# Altium project 105358-3BA002-01_EFM1-hybrid.PrjPCB (part 2 of 2)

## Sheet 105358-3SC002-01-A_IR.SchDoc: I/O Board
size 420 x 297 mm; DrawnBy: JeSa , KaKa; Organization: Hotswap Norden AB; Address1: Knarrarnäsgatan 7; Address2: SE-164 40 Kista; Address3: Sweden; DocumentNumber: 105358-3SC001-01; SheetNumber: 5; SheetTotal: 5; PageSetup: Record=PageOptions|CenterHorizontal=True|CenterVertical=True|PrintScale=0.96|XCorrection=1.00|YCorrection=1.00|PrintKind=0|BorderSize=5000000|LeftOffset=0|BottomOffset=0|Orientation=2|PaperLength=1000|PaperWidth=1000|Scale=100|PaperSource=7|PrintQuality=-4|MediaType=1|DitherType=10|PaperKind=A3|PrintScaleMode=1
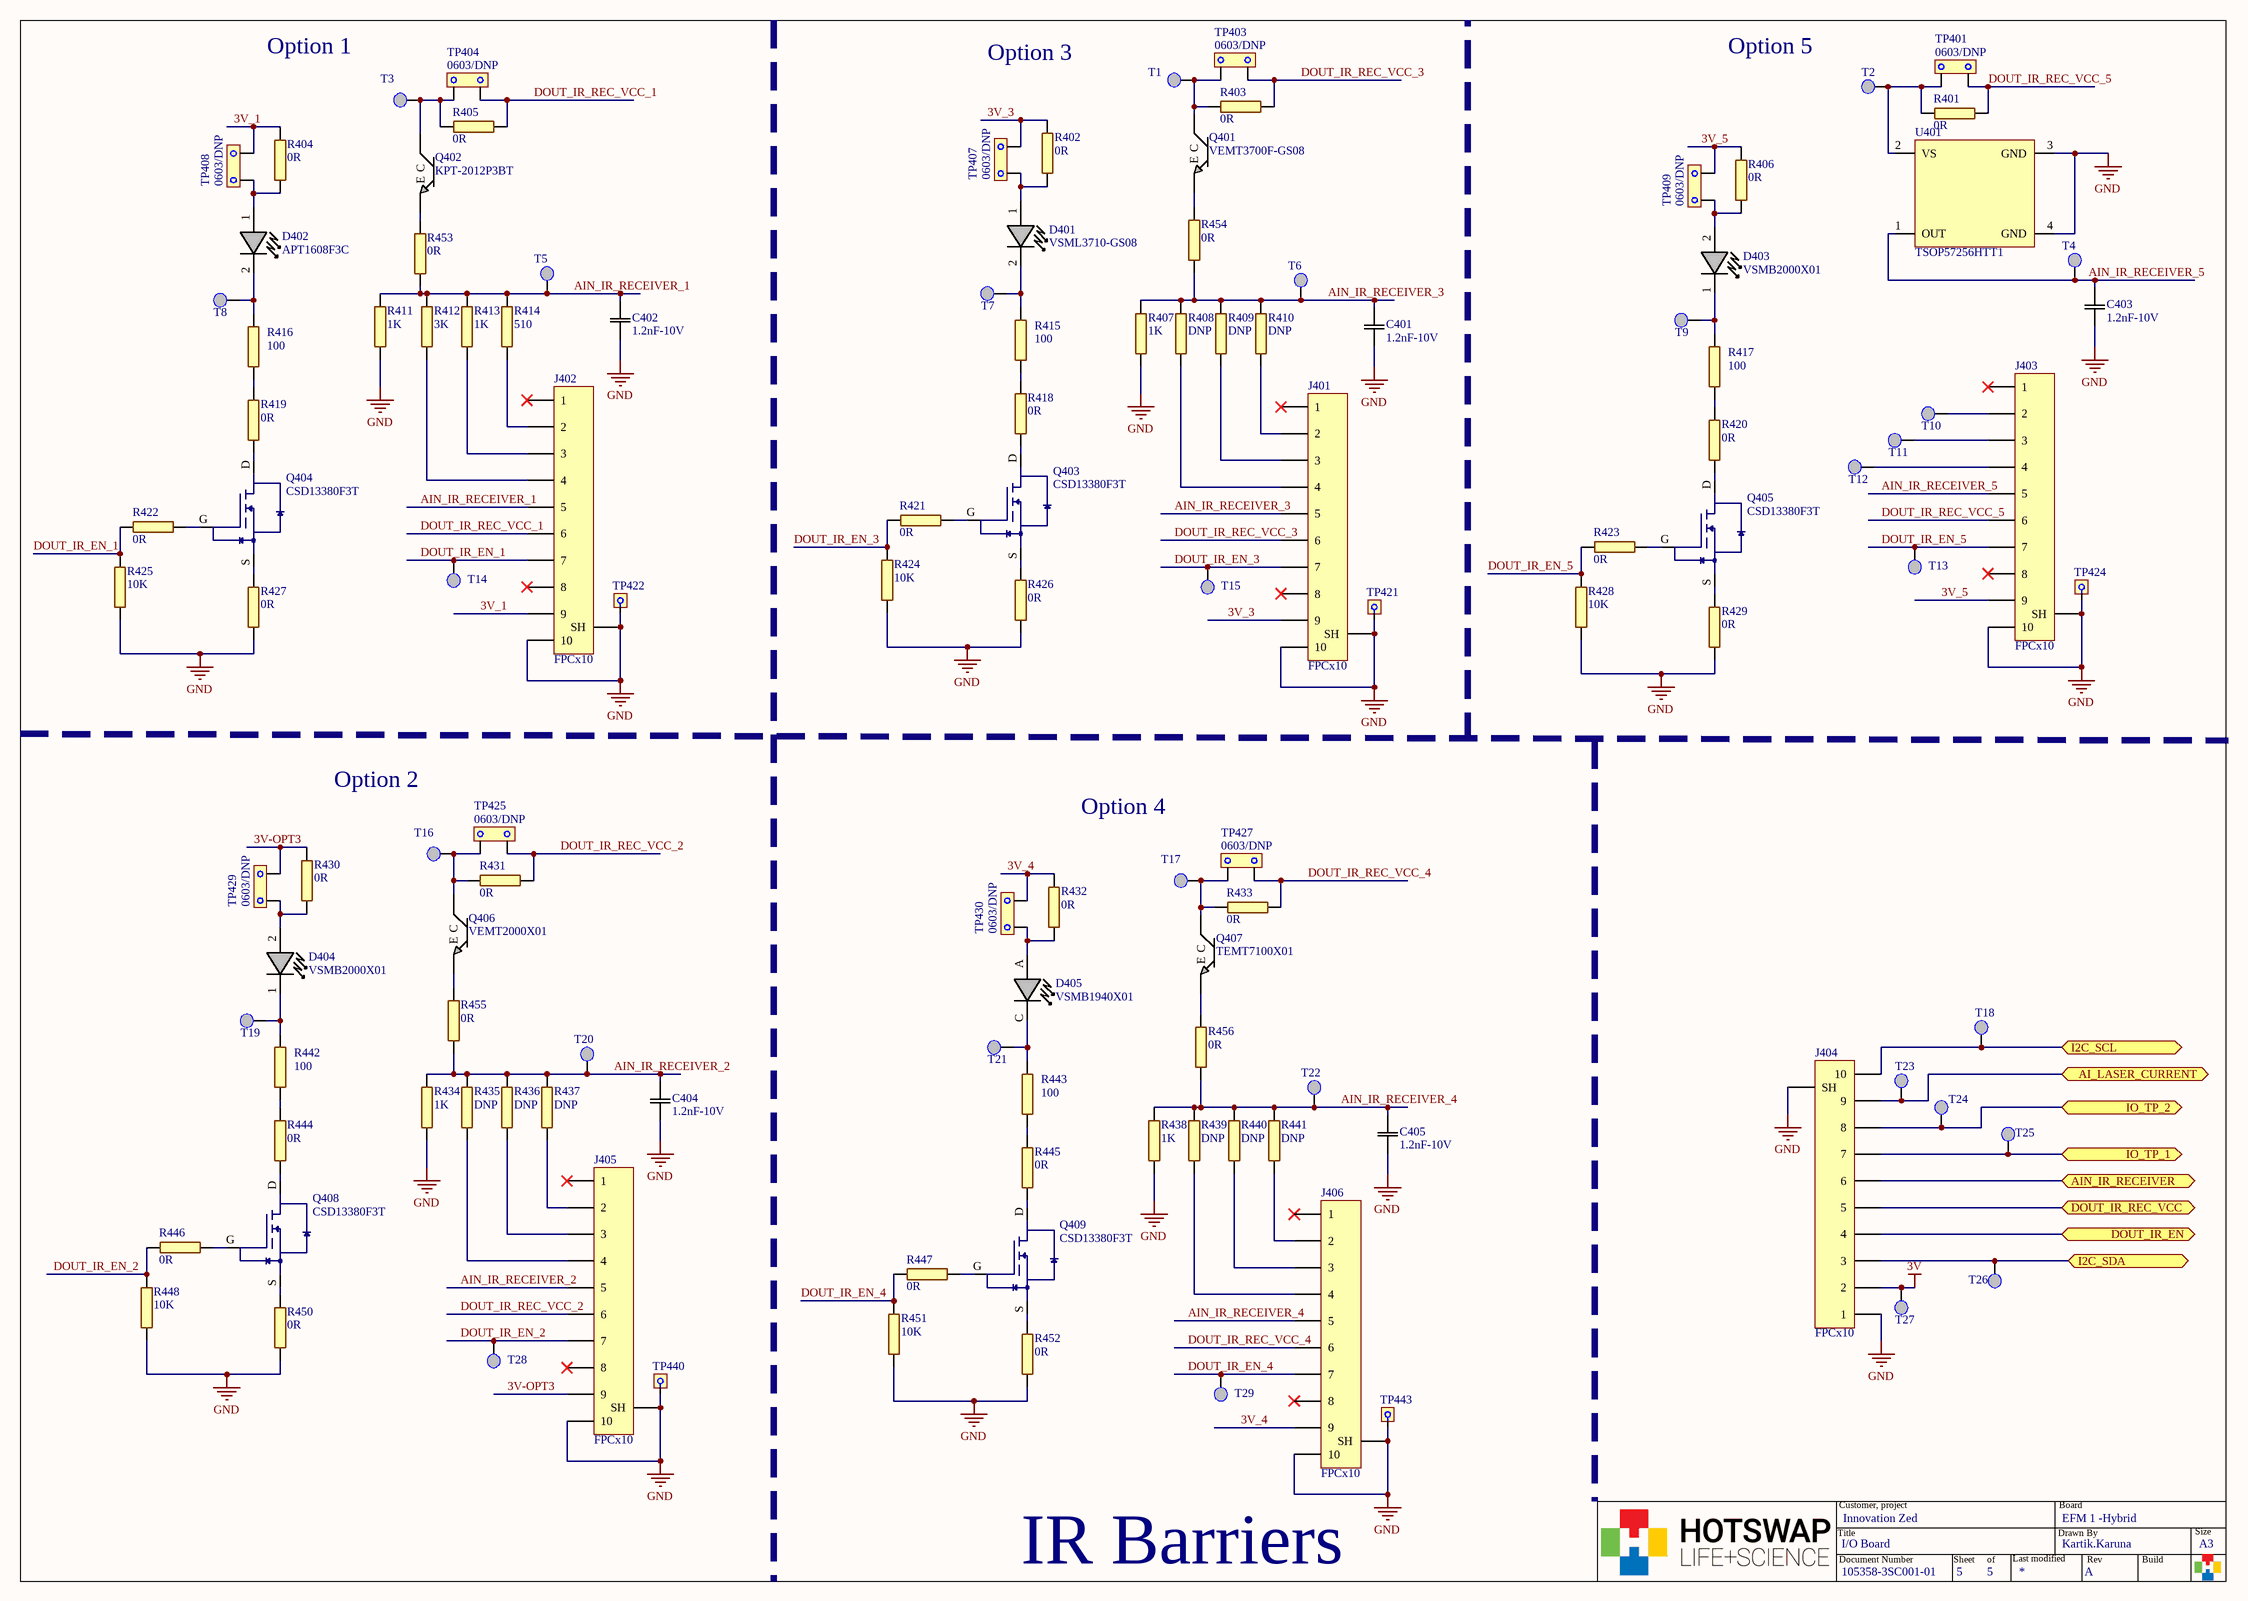
[diagram p4: 105358-3SC002-01-A_IR.SchDoc]

### Parts
C401  1.2nF-10V  [0402C_HIGH_DENSITY]
C402  1.2nF-10V  [0402C_HIGH_DENSITY]
C403  1.2nF-10V  [0402C_HIGH_DENSITY]
C404  1.2nF-10V  [0402C_HIGH_DENSITY]
C405  1.2nF-10V  [0402C_HIGH_DENSITY]
D401  VSML3710-GS08  [VSML3710-GS08]
D402  APT1608F3C  [APT1608F3C]
D403  VSMB2000X01  [SODFL580X160]
D404  VSMB2000X01  [SODFL580X160]
D405  VSMB1940X01  [VSMB1940X01]
J401  FPCx10  [FPCx10-5034801000]
J402  FPCx10  [FPCx10-5034801000]
J403  FPCx10  [FPCx10-5034801000]
J404  FPCx10  [FPCx10-5034801000]
J405  FPCx10  [FPCx10-5034801000]
J406  FPCx10  [FPCx10-5034801000]
Q401  VEMT3700F-GS08  [VEMT3700F-GS08]
Q402  KPT-2012P3BT  [APT2012P3BT]
Q403  CSD13380F3T  [CSD13380F3-DFN40P69X35-3L]
Q404  CSD13380F3T  [CSD13380F3-DFN40P69X35-3L]
Q405  CSD13380F3T  [CSD13380F3-DFN40P69X35-3L]
Q406  VEMT2000X01  [SODFL580X160]
Q407  TEMT7100X01  [TEMT7100X01]
Q408  CSD13380F3T  [CSD13380F3-DFN40P69X35-3L]
Q409  CSD13380F3T  [CSD13380F3-DFN40P69X35-3L]
R401  0R  [0603R-GENRIC]
R402  0R  [0603R-GENRIC]
R403  0R  [0603R-GENRIC]
R404  0R  [0603R-GENRIC]
R405  0R  [0603R-GENRIC]
R406  0R  [0603R-GENRIC]
R407  1K  [0402R-GENERIC]
R408  DNP  [0603R-GENRIC]
R409  DNP  [0603R-GENRIC]
R410  DNP  [0603R-GENRIC]
R411  1K  [0402R-GENERIC]
R412  3K  [0402R-GENERIC]
R413  1K  [0402R-GENERIC]
R414  510  [0402R-GENERIC]
R415  100  [0402R-GENERIC]
R416  100  [0402R-GENERIC]
R417  100  [0402R-GENERIC]
R418  0R  [0603R-GENRIC]
R419  0R  [0603R-GENRIC]
R420  0R  [0603R-GENRIC]
R421  0R  [0603R-GENRIC]
R422  0R  [0603R-GENRIC]
R423  0R  [0603R-GENRIC]
R424  10K  [0402R-GENERIC]
R425  10K  [0402R-GENERIC]
R426  0R  [0603R-GENRIC]
R427  0R  [0603R-GENRIC]
R428  10K  [0402R-GENERIC]
R429  0R  [0603R-GENRIC]
R430  0R  [0603R-GENRIC]
R431  0R  [0603R-GENRIC]
R432  0R  [0603R-GENRIC]
R433  0R  [0603R-GENRIC]
R434  1K  [0402R-GENERIC]
R435  DNP  [0603R-GENRIC]
R436  DNP  [0603R-GENRIC]
R437  DNP  [0603R-GENRIC]
R438  1K  [0402R-GENERIC]
R439  DNP  [0603R-GENRIC]
R440  DNP  [0603R-GENRIC]
R441  DNP  [0603R-GENRIC]
R442  100  [0402R-GENERIC]
R443  100  [0402R-GENERIC]
R444  0R  [0603R-GENRIC]
R445  0R  [0603R-GENRIC]
R446  0R  [0603R-GENRIC]
R447  0R  [0603R-GENRIC]
R448  10K  [0402R-GENERIC]
R450  0R  [0603R-GENRIC]
R451  10K  [0402R-GENERIC]
R452  0R  [0603R-GENRIC]
R453  0R  [0603R-GENRIC]
R454  0R  [0603R-GENRIC]
R455  0R  [0603R-GENRIC]
R456  0R  [0603R-GENRIC]
T1  TEST POINT  [PAD TEST POINT]  (value not drawn)  (no BOM)
T2  TEST POINT  [PAD TEST POINT]  (value not drawn)  (no BOM)
T3  TEST POINT  [PAD TEST POINT]  (value not drawn)  (no BOM)
T4  TEST POINT  [PAD TEST POINT]  (value not drawn)  (no BOM)
T5  TEST POINT  [PAD TEST POINT]  (value not drawn)  (no BOM)
T6  TEST POINT  [PAD TEST POINT]  (value not drawn)  (no BOM)
T7  TEST POINT  [PAD TEST POINT]  (value not drawn)  (no BOM)
T8  TEST POINT  [PAD TEST POINT]  (value not drawn)  (no BOM)
T9  TEST POINT  [PAD TEST POINT]  (value not drawn)  (no BOM)
T10  TEST POINT  [PAD TEST POINT]  (value not drawn)  (no BOM)
T11  TEST POINT  [PAD TEST POINT]  (value not drawn)  (no BOM)
T12  TEST POINT  [PAD TEST POINT]  (value not drawn)  (no BOM)
T13  TEST POINT  [PAD TEST POINT]  (value not drawn)  (no BOM)
T14  TEST POINT  [PAD TEST POINT]  (value not drawn)  (no BOM)
T15  TEST POINT  [PAD TEST POINT]  (value not drawn)  (no BOM)
T16  TEST POINT  [PAD TEST POINT]  (value not drawn)  (no BOM)
T17  TEST POINT  [PAD TEST POINT]  (value not drawn)  (no BOM)
T18  TEST POINT  [PAD TEST POINT]  (value not drawn)  (no BOM)
T19  TEST POINT  [PAD TEST POINT]  (value not drawn)  (no BOM)
T20  TEST POINT  [PAD TEST POINT]  (value not drawn)  (no BOM)
T21  TEST POINT  [PAD TEST POINT]  (value not drawn)  (no BOM)
T22  TEST POINT  [PAD TEST POINT]  (value not drawn)  (no BOM)
T23  TEST POINT  [PAD TEST POINT]  (value not drawn)  (no BOM)
T24  TEST POINT  [PAD TEST POINT]  (value not drawn)  (no BOM)
T25  TEST POINT  [PAD TEST POINT]  (value not drawn)  (no BOM)
T26  TEST POINT  [PAD TEST POINT]  (value not drawn)  (no BOM)
T27  TEST POINT  [PAD TEST POINT]  (value not drawn)  (no BOM)
T28  TEST POINT  [PAD TEST POINT]  (value not drawn)  (no BOM)
T29  TEST POINT  [PAD TEST POINT]  (value not drawn)  (no BOM)
TP401  0603/DNP  [TESTPOINT_C_R0608]  (no BOM)
TP403  0603/DNP  [TESTPOINT_C_R0608]  (no BOM)
TP404  0603/DNP  [TESTPOINT_C_R0608]  (no BOM)
TP407  0603/DNP  [TESTPOINT_C_R0608]  (no BOM)
TP408  0603/DNP  [TESTPOINT_C_R0608]  (no BOM)
TP409  0603/DNP  [TESTPOINT_C_R0608]  (no BOM)
TP421  TP_V_HOOK  [Testpoint_Hook]  (value not drawn)  (no BOM)
TP422  TP_V_HOOK  [Testpoint_Hook]  (value not drawn)  (no BOM)
TP424  TP_V_HOOK  [Testpoint_Hook]  (value not drawn)  (no BOM)
TP425  0603/DNP  [TESTPOINT_C_R0608]  (no BOM)
TP427  0603/DNP  [TESTPOINT_C_R0608]  (no BOM)
TP429  0603/DNP  [TESTPOINT_C_R0608]  (no BOM)
TP430  0603/DNP  [TESTPOINT_C_R0608]  (no BOM)
TP440  TP_V_HOOK  [Testpoint_Hook]  (value not drawn)  (no BOM)
TP443  TP_V_HOOK  [Testpoint_Hook]  (value not drawn)  (no BOM)
U401  TSOP57256HTT1  [TSOP57256HTT1]

### Ports
AI_LASER_CURRENT, AIN_IR_RECEIVER, DOUT_IR_EN, DOUT_IR_REC_VCC, I2C_SCL, I2C_SDA, IO_TP_1, IO_TP_2

### Nets
3V: J404.2 T27.1(Test_Point)
GND: C401.1 C402.1 C403.1 C404.1 C405.1 J401.10 J401.SH J402.10 J402.SH J403.10 J403.SH J404.1 J404.SH J405.10 J405.SH J406.10 J406.SH R407.2 R411.2 R424.2 R425.2 R426.1 R427.1 R428.2 R429.1 R434.2 R438.2 R448.2 R450.1 R451.2 R452.1 TP421.1 TP422.1 TP424.1 TP440.1 TP443.1 U401.3(GND) U401.4(GND)
3V-OPT3: J405.9 R430.2 TP429.2
3V_1: J402.9 R404.2 TP408.2
3V_3: J401.9 R402.2 TP407.2
3V_4: J406.9 R432.2 TP430.2
3V_5: J403.9 R406.2 TP409.2
AI_LASER_CURRENT: J404.9 T23.1(Test_Point) ; port AI_LASER_CURRENT
AIN_IR_RECEIVER: J404.6 ; port AIN_IR_RECEIVER
AIN_IR_RECEIVER_1: C402.2 J402.5 R411.1 R412.1 R413.1 R414.1 R453.2 T5.1(Test_Point)
AIN_IR_RECEIVER_2: C404.2 J405.5 R434.1 R435.1 R436.1 R437.1 R455.2 T20.1(Test_Point)
AIN_IR_RECEIVER_3: C401.2 J401.5 R407.1 R408.1 R409.1 R410.1 R454.2 T6.1(Test_Point)
AIN_IR_RECEIVER_4: C405.2 J406.5 R438.1 R439.1 R440.1 R441.1 R456.2 T22.1(Test_Point)
AIN_IR_RECEIVER_5: C403.2 J403.5 T4.1(Test_Point) U401.1(OUT)
DOUT_IR_EN: J404.4 ; port DOUT_IR_EN
DOUT_IR_EN_1: J402.7 R422.1 R425.1 T14.1(Test_Point)
DOUT_IR_EN_2: J405.7 R446.1 R448.1 T28.1(Test_Point)
DOUT_IR_EN_3: J401.7 R421.1 R424.1 T15.1(Test_Point)
DOUT_IR_EN_4: J406.7 R447.1 R451.1 T29.1(Test_Point)
DOUT_IR_EN_5: J403.7 R423.1 R428.1 T13.1(Test_Point)
DOUT_IR_REC_VCC: J404.5 ; port DOUT_IR_REC_VCC
DOUT_IR_REC_VCC_1: J402.6 R405.2 TP404.2
DOUT_IR_REC_VCC_2: J405.6 R431.2 TP425.2
DOUT_IR_REC_VCC_3: J401.6 R403.2 TP403.2
DOUT_IR_REC_VCC_4: J406.6 R433.2 TP427.2
DOUT_IR_REC_VCC_5: J403.6 R401.2 TP401.2
I2C_SCL: J404.10 T18.1(Test_Point) ; port I2C_SCL
I2C_SDA: J404.3 T26.1(Test_Point) ; port I2C_SDA
IO_TP_1: J404.7 T25.1(Test_Point) ; port IO_TP_1
IO_TP_2: J404.8 T24.1(Test_Point) ; port IO_TP_2
NetD401_1: D401.1(A) R402.1 TP407.1
NetD401_2: D401.2(C) R415.1 T7.1(Test_Point)
NetD402_1: D402.1(A) R404.1 TP408.1
NetD402_2: D402.2(K) R416.1 T8.1(Test_Point)
NetD403_1: D403.1(C) R417.1 T9.1(Test_Point)
NetD403_2: D403.2(A) R406.1 TP409.1
NetD404_1: D404.1(C) R442.1 T19.1(Test_Point)
NetD404_2: D404.2(A) R430.1 TP429.1
NetD405_A: D405.A R432.1 TP430.1
NetD405_C: D405.C R443.1 T21.1(Test_Point)
NetJ401_2: J401.2 R410.2
NetJ401_3: J401.3 R409.2
NetJ401_4: J401.4 R408.2
NetJ402_2: J402.2 R414.2
NetJ402_3: J402.3 R413.2
NetJ402_4: J402.4 R412.2
NetJ403_2: J403.2 T10.1(Test_Point)
NetJ403_3: J403.3 T11.1(Test_Point)
NetJ403_4: J403.4 T12.1(Test_Point)
NetJ405_2: J405.2 R437.2
NetJ405_3: J405.3 R436.2
NetJ405_4: J405.4 R435.2
NetJ406_2: J406.2 R441.2
NetJ406_3: J406.3 R440.2
NetJ406_4: J406.4 R439.2
NetQ401_C: Q401.C R403.1 T1.1(Test_Point) TP403.1
NetQ401_E: Q401.E R454.1
NetQ402_1: Q402.1(E) R453.1
NetQ402_2: Q402.2(C) R405.1 T3.1(Test_Point) TP404.1
NetQ403_D: Q403.D R418.2
NetQ403_G: Q403.G R421.2
NetQ403_S: Q403.S R426.2
NetQ404_D: Q404.D R419.2
NetQ404_G: Q404.G R422.2
NetQ404_S: Q404.S R427.2
NetQ405_D: Q405.D R420.2
NetQ405_G: Q405.G R423.2
NetQ405_S: Q405.S R429.2
NetQ406_1: Q406.1(C) R431.1 T16.1(Test_Point) TP425.1
NetQ406_2: Q406.2(E) R455.1
NetQ407_C: Q407.C R433.1 T17.1(Test_Point) TP427.1
NetQ407_E: Q407.E R456.1
NetQ408_D: Q408.D R444.2
NetQ408_G: Q408.G R446.2
NetQ408_S: Q408.S R450.2
NetQ409_D: Q409.D R445.2
NetQ409_G: Q409.G R447.2
NetQ409_S: Q409.S R452.2
NetR401_1: R401.1 T2.1(Test_Point) TP401.1 U401.2(VS)
NetR415_2: R415.2 R418.1
NetR416_2: R416.2 R419.1
NetR417_2: R417.2 R420.1
NetR442_2: R442.2 R444.1
NetR443_2: R443.2 R445.1

Not connected (* = marked no-connect by the designer): J401 1* 8*; J402 1* 8*; J403 1* 8*; J405 1* 8*; J406 1* 8*

### Notes on the sheet
- Option 1
- Option 3
- Option 5
- Option 2
- Option 4
- (near J406) IR Barriers
- Title
- Customer, project
- Drawn By
- Board
- Size
- Document Number
- Sheet
- of
- Last modified
- Rev
- Build
- A3

### Library data of the parts
C401-C405 = 0402C-1.2nF-10V: 1.2nF ±10% 10V U2J Ceramic Capacitor 0402; Manufacturer Part Number: GRM1557U1A122JA01D; Manufacturer: Murata Electronics North America; Tolerance: 5%; Capacitance: 1.2nF; Digi-Key Part Number: 490-6272-1-ND; PackageReference: 0402; Temperature Coefficient: U2J; Voltage - Rated: 10V
D401 = VSML3710-GS08: EMITTER IR 940NM 100MA PLCC; Manufacturer: Vishay Semiconductor Opto Division; Type: Infrared (IR); Radiant Intensity (Ie) Min @ If: 4mW/sr @ 100mA; Voltage - Forward (Vf) (Typ): 1.35V; Viewing Angle: 120°; Manufacturer Part Number: VSML3710-GS08; PackageReference: 2-PLCC; Wavelength: 940nm; Current - DC Forward (If) (Max): 100mA; Mounting Type: Surface Mount; Operating Temperature: -40°C ~ 85°C (TA); ComponentLink1Description: Datasheet; ComponentLink1URL: http://www.vishay.com/docs/81300/vsml3710.pdf; Digi-Key Part Number: 751-1257-1-ND
D402 = APT1608F3C: 0603 INFRARED DIODE; Manufacturer: Kingbright; Wavelength: 940nm; Type: Infrared (IR); Current - DC Forward (If) (Max): 50mA; Radiant Intensity (Ie) Min @ If: 1.2mW/sr @ 20mA; Voltage - Forward (Vf) (Typ): 1.2V; Viewing Angle: 120°; Supplier 1: Digi-Key; Supplier Part Number 1: 754-1433-1-ND; Manufacturer Part Number: APT1608F3C; PackageReference: 0603; Mounting Type: Surface Mount; Operating Temperature: -40°C ~ 85°C (TA); ComponentLink1Description: Datasheet; ComponentLink1URL: http://www.kingbrightusa.com/images/catalog/SPEC/APT1608F3C.pdf; Digi-Key Part Number: 754-1433-1-ND; ClassName: 3D_EXPORT
D403 D404 = VSMB2000X01: EMITTER IR 940NM 100MA SMD; Manufacturer: Vishay Semiconductor Opto Division; Type: Infrared (IR); Radiant Intensity (Ie) Min @ If: 20mW/sr @ 100mA; Voltage - Forward (Vf) (Typ): 1.35V; Viewing Angle: 24°; Manufacturer Part Number: VSMB2000X01; PackageReference: 2-SMD, Z-Bend; Wavelength: 940nm; Current - DC Forward (If) (Max): 100mA; Mounting Type: Surface Mount; Operating Temperature: -40°C ~ 85°C (TA); ComponentLink1Description: Datasheet; ComponentLink1URL: http://www.vishay.com/docs/81930/vsmb2000.pdf; Digi-Key Part Number: VSMB2000X01CT-ND
D405 = VSMB1940X01: EMITTER IR 940NM 100MA 0805; Manufacturer: Vishay Semiconductor Opto Division; Type: Infrared (IR); Radiant Intensity (Ie) Min @ If: 3mW/sr @ 100mA; Voltage - Forward (Vf) (Typ): 1.35V; Viewing Angle: 120°; Manufacturer Part Number: VSMB1940X01; PackageReference: 0805; Wavelength: 940nm; Current - DC Forward (If) (Max): 100mA; Mounting Type: Surface Mount; Operating Temperature: -40°C ~ 85°C (TA); ComponentLink1Description: Datasheet; ComponentLink1URL: http://www.vishay.com/docs/81933/vsmb1940.pdf; Digi-Key Part Number: VSMB1940X01CT-ND
J401-J406 = FPCx10: CONN FFC FPC 10POS 0.50MM R/A; Manufacturer Part Number: 5034801000; Manufacturer: Molex, LLC; ComponentLink1URL: http://www.molex.com/pdm_docs/sd/5034801000_sd.pdf; ComponentLink1Description: Datasheet; Mounting Type: SMD; Digi-Key Part Number: WM1389CT-ND
Q401 = VEMT3700F-GS08: PHOTO TRANS. SMD PLCC2; Manufacturer: Vishay Semiconductor Opto Division; Voltage - Collector Emitter Breakdown (Max): 70V; Current - Collector (Ic) (Max): 50mA; Current - Dark (Id) (Max): 200nA; Power - Max: 100mW; Wavelength: 940nm; Viewing Angle: 120°; ComponentLink1Description: Datasheet; ComponentLink1URL: http://www.vishay.com/docs/81584/vemt3700.pdf; Manufacturer Part Number: VEMT3700F-GS08; PackageReference: 2-LCC (J-Lead); Digi-Key Part Number: VEMT3700F-GS08CT-ND; Operating Temperature: -40°C ~ 100°C (TA)
Q402 = APT2012P3BT: 0805 PHOTOTRANSISTOR; Manufacturer: Kingbright; Voltage - Collector Emitter Breakdown (Max): 30V; Current - Collector (Ic) (Max): 1mA; Current - Dark (Id) (Max): 100nA; Power - Max: 100mW; Supplier 1: Digi-Key; Supplier Part Number 1: 754-1436-1-ND; ComponentLink1Description: Datasheet; ComponentLink1URL: https://www.kingbrightusa.com/images/catalog/spec/APT2012P3BT.pdf; Manufacturer Part Number: KPT-2012P3BT; PackageReference: 0805; Digi-Key Part Number: 754-1436-1-ND
Q403-Q405 Q408 Q409 = CSD13380F3T: 12V N-CHANNEL FEMTOFET MOSFET; Manufacturer: Texas Instruments; Digi-Key Part Number: CSD13380F3T; Manufacturer Part Number: CSD13380F3T; FET Type: N-Channel; Package / Case: 3-XFDFN; ComponentLink1Description: Datasheet; ComponentLink1URL: http://www.ti.com/lit/ds/symlink/csd13380f3.pdf
Q406 = VEMT2000X01: PHOTOTRANSISTOR NPN REV GULLWING; Manufacturer: Vishay Semiconductor Opto Division; Voltage - Collector Emitter Breakdown (Max): 20V; Current - Collector (Ic) (Max): 50mA; Current - Dark (Id) (Max): 100nA; Power - Max: 100mW; Wavelength: 860nm; Viewing Angle: 30°; ComponentLink1Description: Datasheet; ComponentLink1URL: http://www.vishay.com/docs/81595/vemt2000.pdf; Manufacturer Part Number: VEMT2000X01; PackageReference: 2-SMD, Z-Bend; Digi-Key Part Number: VEMT2000X01CT-ND; Operating Temperature: -40°C ~ 100°C (TA)
Q407 = TEMT7100X01: PHOTOTRANSISTOR 870NM 0805 SMD; Manufacturer: Vishay Semiconductor Opto Division; Voltage - Collector Emitter Breakdown (Max): 20V; Current - Collector (Ic) (Max): 20mA; Current - Dark (Id) (Max): 100µA; Power - Max: 100mW; ComponentLink1Description: Datasheet; ComponentLink1URL: http://www.vishay.com/docs/81770/temt7100.pdf; Manufacturer Part Number: TEMT7100X01; PackageReference: 0805; Digi-Key Part Number: TEMT7100X01CT-ND; Operating Temperature: -40°C ~ 100°C (TA); Wavelength: 870nm
R401-R406 R418-R423 R426 R427 R429-R433 R444-R447 R450 R452-R456 = 0603R-0R -1%-0.063W: RES SMD 0 OHM 1% 1/10W 0603; Power: 0.063W; GENERIC_OK: YES; Resistance (Ohms): 0R; PackageReference: 0603
R407 R411 R413 R434 R438 = 0402R-1k OHM-1%-0.063W: RES SMD 1kOHM 1% 1/16W 0402; Power: 0.063W; GENERIC_OK: YES; Resistance (Ohms): 1KOhm; Tolerance: 1%; PackageReference: 0402
R408-R410 R435-R437 R439-R441 = 0603R_DNP: RES 0603 DNP; GENERIC_OK: YES; PackageReference: 0603
R412 = 0402R-3k OHM-1%-0.063W: RES SMD 3kOHM 1% 1/16W 0402; Power: 0.063W; GENERIC_OK: YES; Resistance (Ohms): 3KOhm; Tolerance: 1%; PackageReference: 0402; Features: Moisture Resistant
R414 = 0402R-500 OHM-1%-0.063W: RES SMD 100OHM 1% 1/16W 0402; Resistance (Ohms): 510Ohm; Power: 0.063W; GENERIC_OK: YES; Tolerance: 1%; PackageReference: 0402
R415-R417 R442 R443 = 0402R-100 OHM-1%-0.063W: RES SMD 100OHM 1% 1/16W 0402; Manufacturer: Yageo; Manufacturer Part Number: RC0402FR-07100RL; Power: 0.063W; GENERIC_OK: YES; Digi-Key Part Number: 311-100LRCT-ND; Resistance (Ohms): 100Ohm; Tolerance: 1%; PackageReference: 0402; Features: Moisture Resistant
R424 R425 R428 R448 R451 = 0402R-10k OHM-1%-0.063W: RES SMD 10kOHM 1% 1/16W 0402; Manufacturer: Yageo; Manufacturer Part Number: RC0402FR-0710KL; Power: 0.063W; GENERIC_OK: YES; Digi-Key Part Number: 311-10.0KLRCT-ND; Resistance (Ohms): 10KOhm; Tolerance: 1%; PackageReference: 0402; Features: Moisture Resistant
T1-T29 = TEST POINT: Testing Poiny
TP401 TP403 TP404 TP407-TP409 TP425 TP427 TP429 TP430 = TP_C_R0603: Test point for Med Current 0402 JUMPER SMD O OHM 1% 1/4W 0603; ClassName: TP
TP421 TP422 TP424 TP440 TP443 = TP_V_HOOK: Black PC Test Point; Manufacturer: Keystone Electronics; Manufacturer Part Number: 5001; Digi-Key Part Number: 36-5001-ND
U401 = TSOP57256HTT1: MOD IR RCVR 56KHZ TOP VIEW SHIEL; Manufacturer: Vishay Semiconductor Opto Division; Voltage Supply: 2.5V ~ 5.5V; Current Supply: 700µA; B.P.F. Center Frequency: 56.0kHz; Sensing Distance: 40m; ComponentLink1URL: http://www.vishay.com/docs/82434/tsop572.pdf; ComponentLink1Description: Datasheet; Manufacturer Part Number: TSOP57256HTT1; Digi-Key Part Number: TSOP57256HTT1-ND

## Sheet 105358-3SC002-01-A_IR_extra.SchDoc: I/O Board
size 420 x 297 mm; DrawnBy: JeSa , KaKa; Organization: Hotswap Norden AB; Address1: Knarrarnäsgatan 7; Address2: SE-164 40 Kista; Address3: Sweden; DocumentNumber: 105358-3SC001-01; SheetNumber: 5; SheetTotal: 5; PageSetup: Record=PageOptions|CenterHorizontal=True|CenterVertical=True|PrintScale=0.96|XCorrection=1.00|YCorrection=1.00|PrintKind=0|BorderSize=5000000|LeftOffset=0|BottomOffset=0|Orientation=2|PaperLength=1000|PaperWidth=1000|Scale=100|PaperSource=7|PrintQuality=-4|MediaType=1|DitherType=10|PaperKind=A3|PrintScaleMode=1
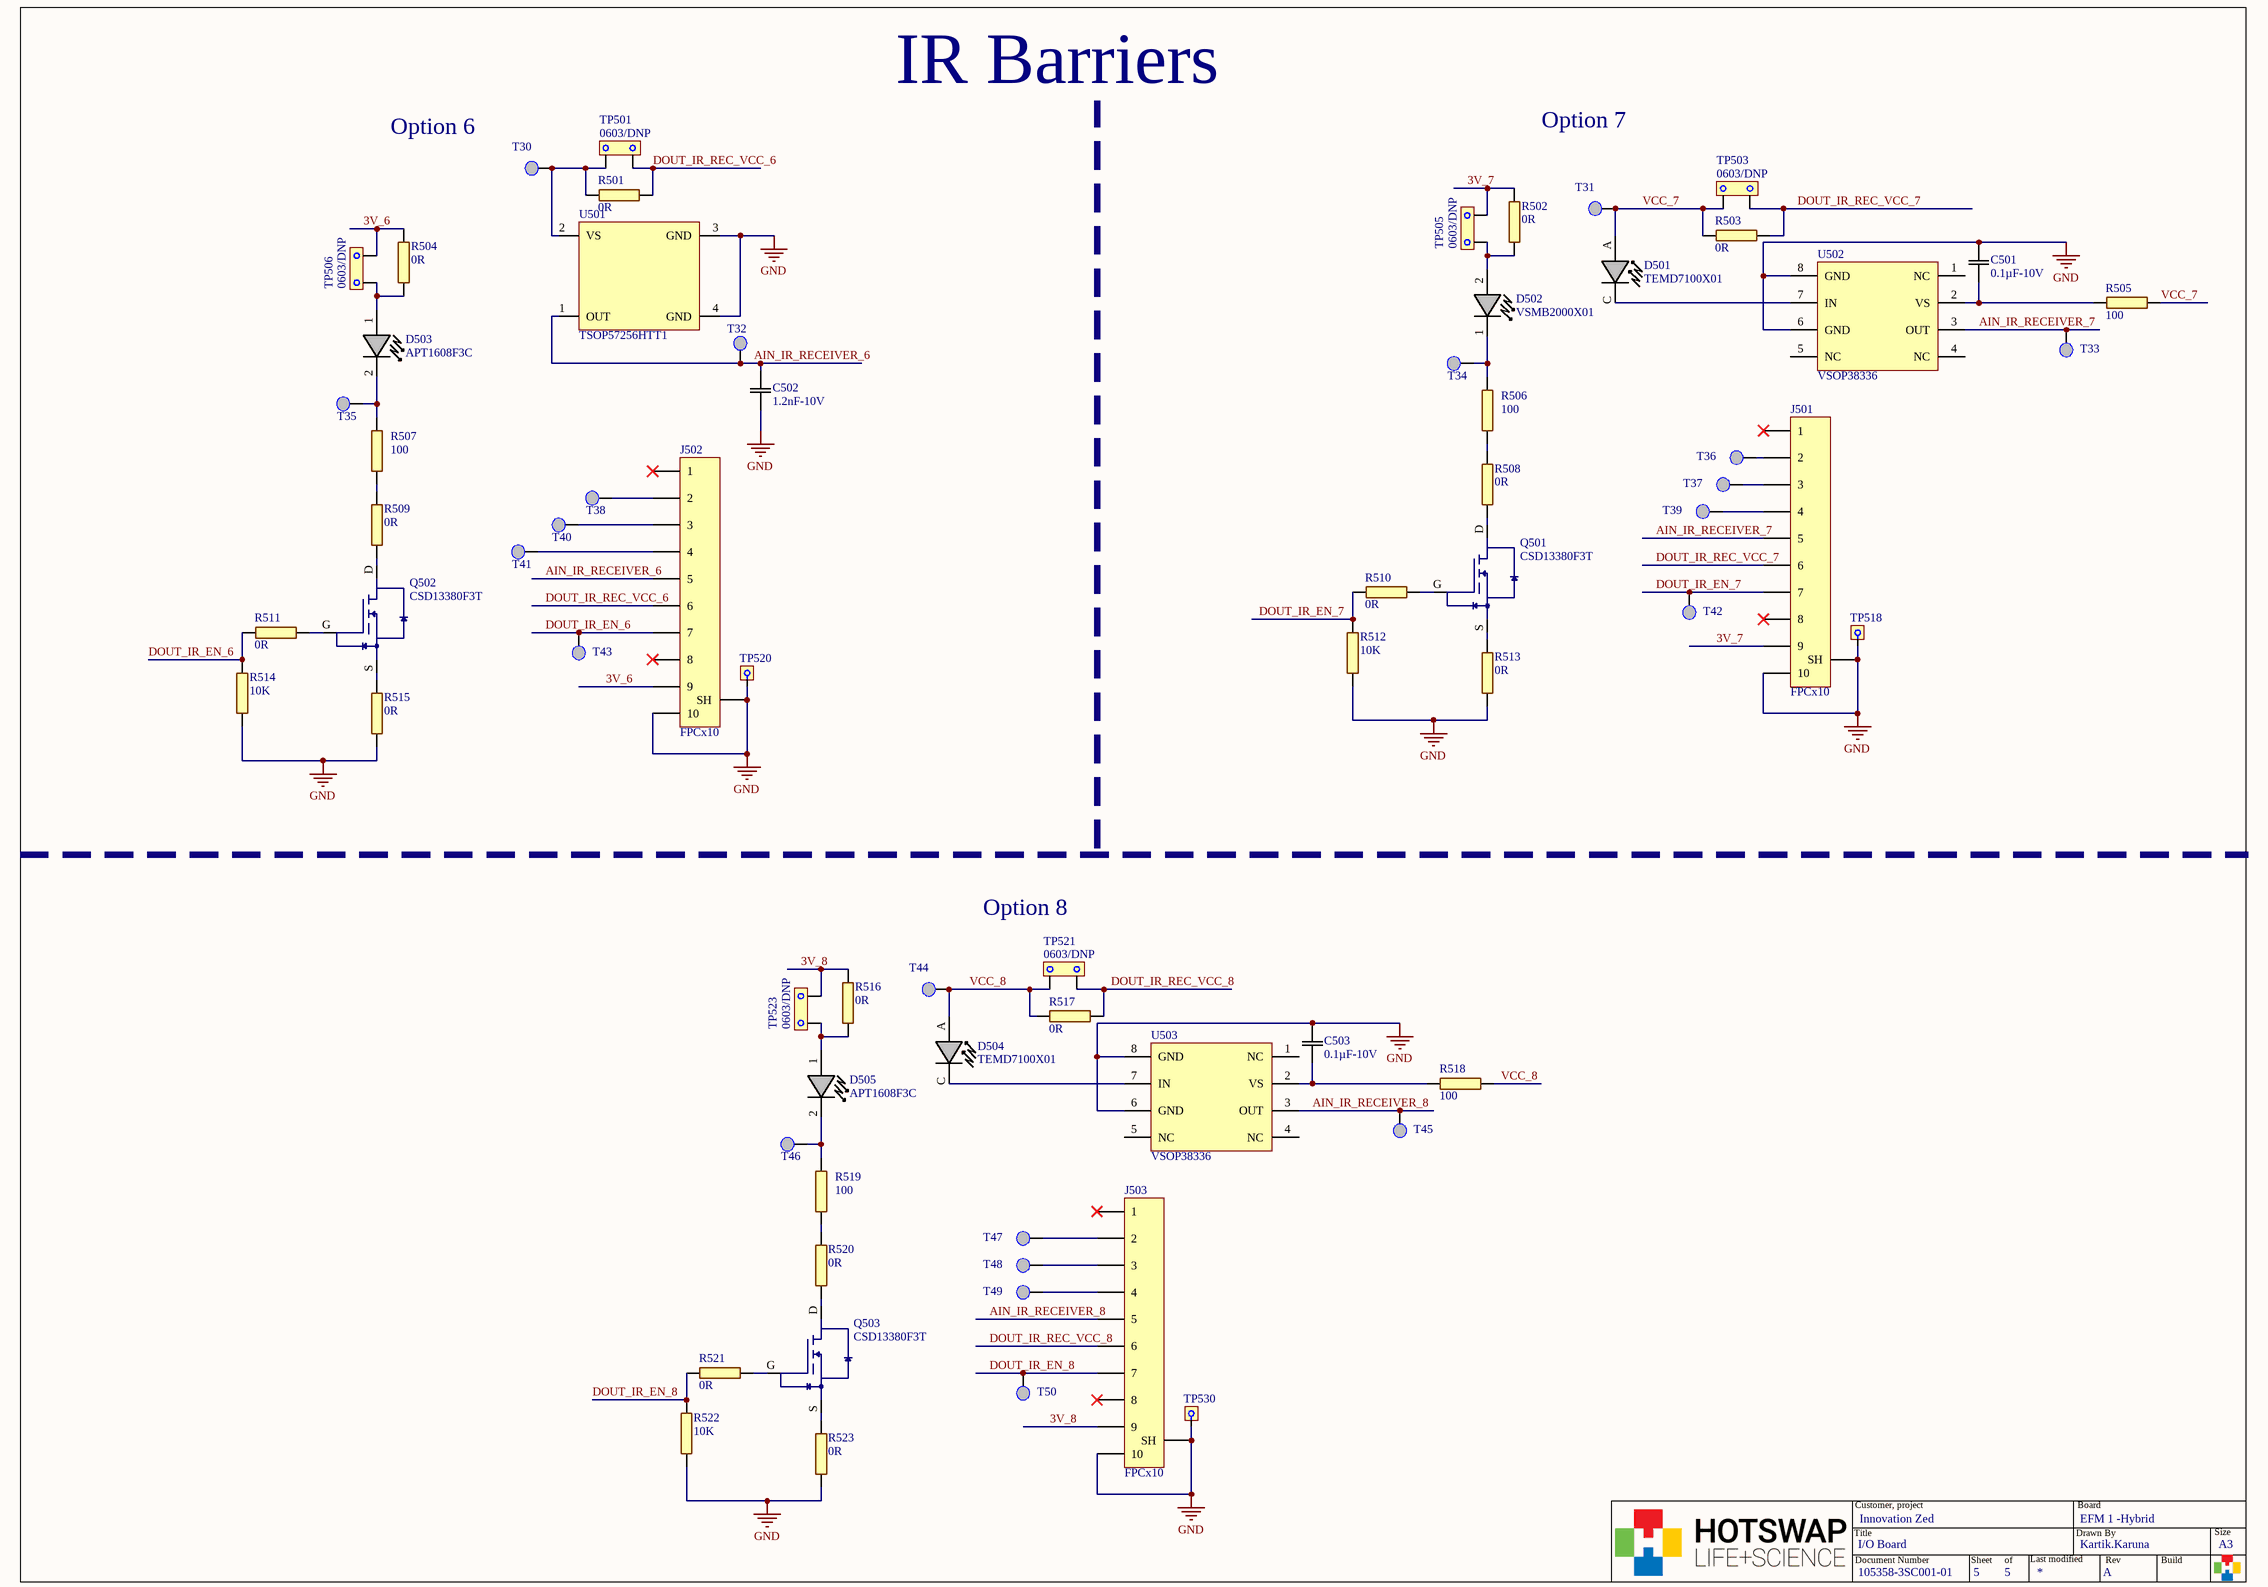
[diagram p5: 105358-3SC002-01-A_IR_extra.SchDoc]

### Parts
C501  0.1µF-10V  [0402C_HIGH_DENSITY]
C502  1.2nF-10V  [0402C_HIGH_DENSITY]
C503  0.1µF-10V  [0402C_HIGH_DENSITY]
D501  TEMD7100X01  [TEMD7100X01]
D502  VSMB2000X01  [SODFL580X160]
D503  APT1608F3C  [APT1608F3C]
D504  TEMD7100X01  [TEMD7100X01]
D505  APT1608F3C  [APT1608F3C]
J501  FPCx10  [FPCx10-5034801000]
J502  FPCx10  [FPCx10-5034801000]
J503  FPCx10  [FPCx10-5034801000]
Q501  CSD13380F3T  [CSD13380F3-DFN40P69X35-3L]
Q502  CSD13380F3T  [CSD13380F3-DFN40P69X35-3L]
Q503  CSD13380F3T  [CSD13380F3-DFN40P69X35-3L]
R501  0R  [0603R-GENRIC]
R502  0R  [0603R-GENRIC]
R503  0R  [0603R-GENRIC]
R504  0R  [0603R-GENRIC]
R505  100  [0402R-GENERIC]
R506  100  [0402R-GENERIC]
R507  100  [0402R-GENERIC]
R508  0R  [0603R-GENRIC]
R509  0R  [0603R-GENRIC]
R510  0R  [0603R-GENRIC]
R511  0R  [0603R-GENRIC]
R512  10K  [0402R-GENERIC]
R513  0R  [0603R-GENRIC]
R514  10K  [0402R-GENERIC]
R515  0R  [0603R-GENRIC]
R516  0R  [0603R-GENRIC]
R517  0R  [0603R-GENRIC]
R518  100  [0402R-GENERIC]
R519  100  [0402R-GENERIC]
R520  0R  [0603R-GENRIC]
R521  0R  [0603R-GENRIC]
R522  10K  [0402R-GENERIC]
R523  0R  [0603R-GENRIC]
T30  TEST POINT  [PAD TEST POINT]  (value not drawn)  (no BOM)
T31  TEST POINT  [PAD TEST POINT]  (value not drawn)  (no BOM)
T32  TEST POINT  [PAD TEST POINT]  (value not drawn)  (no BOM)
T33  TEST POINT  [PAD TEST POINT]  (value not drawn)  (no BOM)
T34  TEST POINT  [PAD TEST POINT]  (value not drawn)  (no BOM)
T35  TEST POINT  [PAD TEST POINT]  (value not drawn)  (no BOM)
T36  TEST POINT  [PAD TEST POINT]  (value not drawn)  (no BOM)
T37  TEST POINT  [PAD TEST POINT]  (value not drawn)  (no BOM)
T38  TEST POINT  [PAD TEST POINT]  (value not drawn)  (no BOM)
T39  TEST POINT  [PAD TEST POINT]  (value not drawn)  (no BOM)
T40  TEST POINT  [PAD TEST POINT]  (value not drawn)  (no BOM)
T41  TEST POINT  [PAD TEST POINT]  (value not drawn)  (no BOM)
T42  TEST POINT  [PAD TEST POINT]  (value not drawn)  (no BOM)
T43  TEST POINT  [PAD TEST POINT]  (value not drawn)  (no BOM)
T44  TEST POINT  [PAD TEST POINT]  (value not drawn)  (no BOM)
T45  TEST POINT  [PAD TEST POINT]  (value not drawn)  (no BOM)
T46  TEST POINT  [PAD TEST POINT]  (value not drawn)  (no BOM)
T47  TEST POINT  [PAD TEST POINT]  (value not drawn)  (no BOM)
T48  TEST POINT  [PAD TEST POINT]  (value not drawn)  (no BOM)
T49  TEST POINT  [PAD TEST POINT]  (value not drawn)  (no BOM)
T50  TEST POINT  [PAD TEST POINT]  (value not drawn)  (no BOM)
TP501  0603/DNP  [TESTPOINT_C_R0608]  (no BOM)
TP503  0603/DNP  [TESTPOINT_C_R0608]  (no BOM)
TP505  0603/DNP  [TESTPOINT_C_R0608]  (no BOM)
TP506  0603/DNP  [TESTPOINT_C_R0608]  (no BOM)
TP518  TP_V_HOOK  [Testpoint_Hook]  (value not drawn)  (no BOM)
TP520  TP_V_HOOK  [Testpoint_Hook]  (value not drawn)  (no BOM)
TP521  0603/DNP  [TESTPOINT_C_R0608]  (no BOM)
TP523  0603/DNP  [TESTPOINT_C_R0608]  (no BOM)
TP530  TP_V_HOOK  [Testpoint_Hook]  (value not drawn)  (no BOM)
U501  TSOP57256HTT1  [TSOP57256HTT1]
U502  VSOP38336  [VSOP38336]
U503  VSOP38336  [VSOP38336]

### Nets
GND: C501.2 C502.1 C503.2 J501.10 J501.SH J502.10 J502.SH J503.10 J503.SH R512.2 R513.1 R514.2 R515.1 R522.2 R523.1 TP518.1 TP520.1 TP530.1 U501.3(GND) U501.4(GND) U502.6(GND) U502.8(GND) U503.6(GND) U503.8(GND)
3V_6: J502.9 R504.2 TP506.2
3V_7: J501.9 R502.2 TP505.2
3V_8: J503.9 R516.2 TP523.2
AIN_IR_RECEIVER_6: C502.2 J502.5 T32.1(Test_Point) U501.1(OUT)
AIN_IR_RECEIVER_7: J501.5 T33.1(Test_Point) U502.3(OUT)
AIN_IR_RECEIVER_8: J503.5 T45.1(Test_Point) U503.3(OUT)
DOUT_IR_EN_6: J502.7 R511.1 R514.1 T43.1(Test_Point)
DOUT_IR_EN_7: J501.7 R510.1 R512.1 T42.1(Test_Point)
DOUT_IR_EN_8: J503.7 R521.1 R522.1 T50.1(Test_Point)
DOUT_IR_REC_VCC_6: J502.6 R501.2 TP501.2
DOUT_IR_REC_VCC_7: J501.6 R503.2 TP503.2
DOUT_IR_REC_VCC_8: J503.6 R517.2 TP521.2
VCC_7: D501.A R503.1 R505.2 T31.1(Test_Point) TP503.1
VCC_8: D504.A R517.1 R518.2 T44.1(Test_Point) TP521.1
NetC501_1: C501.1 R505.1 U502.2(VS)
NetC503_1: C503.1 R518.1 U503.2(VS)
NetD501_C: D501.C U502.7(IN)
NetD502_1: D502.1(C) R506.1 T34.1(Test_Point)
NetD502_2: D502.2(A) R502.1 TP505.1
NetD503_1: D503.1(A) R504.1 TP506.1
NetD503_2: D503.2(K) R507.1 T35.1(Test_Point)
NetD504_C: D504.C U503.7(IN)
NetD505_1: D505.1(A) R516.1 TP523.1
NetD505_2: D505.2(K) R519.1 T46.1(Test_Point)
NetJ501_2: J501.2 T36.1(Test_Point)
NetJ501_3: J501.3 T37.1(Test_Point)
NetJ501_4: J501.4 T39.1(Test_Point)
NetJ502_2: J502.2 T38.1(Test_Point)
NetJ502_3: J502.3 T40.1(Test_Point)
NetJ502_4: J502.4 T41.1(Test_Point)
NetJ503_2: J503.2 T47.1(Test_Point)
NetJ503_3: J503.3 T48.1(Test_Point)
NetJ503_4: J503.4 T49.1(Test_Point)
NetQ501_D: Q501.D R508.2
NetQ501_G: Q501.G R510.2
NetQ501_S: Q501.S R513.2
NetQ502_D: Q502.D R509.2
NetQ502_G: Q502.G R511.2
NetQ502_S: Q502.S R515.2
NetQ503_D: Q503.D R520.2
NetQ503_G: Q503.G R521.2
NetQ503_S: Q503.S R523.2
NetR501_1: R501.1 T30.1(Test_Point) TP501.1 U501.2(VS)
NetR506_2: R506.2 R508.1
NetR507_2: R507.2 R509.1
NetR519_2: R519.2 R520.1

Not connected (* = marked no-connect by the designer): J501 1* 8*; J502 1* 8*; J503 1* 8*; U502 1(NC) 4(NC) 5(NC); U503 1(NC) 4(NC) 5(NC)

### Notes on the sheet
- IR Barriers
- Option 7
- Option 6
- Option 8
- Title
- Customer, project
- Drawn By
- Board
- Size
- Document Number
- Sheet
- of
- Last modified
- Rev
- Build
- A3

### Library data of the parts
C501 C503 = 0402C-0.1uF-10V: 0.1µF ±10% 10V X5R Ceramic Capacitor 0402; Manufacturer Part Number: CC0402KRX5R6BB104; Manufacturer: Yageo; Capacitance: 0.1µF; Digi-Key Part Number: 311-1336-1-ND; PackageReference: 0402; Temperature Coefficient: X5R; Tolerance: 10%; Voltage - Rated: 10V
C502 = 0402C-1.2nF-10V: as C401 on sheet 105358-3SC002-01-A_IR; Capacitance: 1.2nF; Digi-Key Part Number: 490-6272-1-ND; PackageReference: 0402; Temperature Coefficient: U2J; Voltage - Rated: 10V
D501 D504 = TEMD7100X01: PHOTODIODE PIN 950NM 0805; Manufacturer: Vishay Semiconductor Opto Division; Type: Infrared (IR); Current - Dark (Typ): 1nA; Response Time: 100ns; Voltage - DC Reverse (Vr) (Max): 60V; Viewing Angle: 120°; Supplier 1: Digi-Key; Supplier Part Number 1: 754-1433-1-ND; Manufacturer Part Number: TEMD7100X01; PackageReference: 0805; Wavelength: 950nm; Mounting Type: Surface Mount; Operating Temperature: -40°C ~ 100°C; ComponentLink1Description: Datasheet; ComponentLink1URL: http://www.vishay.com/docs/81960/temd7100.pdf; Digi-Key Part Number: TEMD7100X01CT-ND
D502 = VSMB2000X01: as D403 on sheet 105358-3SC002-01-A_IR; Manufacturer Part Number: VSMB2000X01; PackageReference: 2-SMD, Z-Bend; Wavelength: 940nm; Current - DC Forward (If) (Max): 100mA; Mounting Type: Surface Mount; Operating Temperature: -40°C ~ 85°C (TA); ComponentLink1Description: Datasheet; ComponentLink1URL: http://www.vishay.com/docs/81930/vsmb2000.pdf; Digi-Key Part Number: VSMB2000X01CT-ND
D503 D505 = APT1608F3C: as D402 on sheet 105358-3SC002-01-A_IR; Manufacturer Part Number: APT1608F3C; PackageReference: 0603; Mounting Type: Surface Mount; Operating Temperature: -40°C ~ 85°C (TA); ComponentLink1Description: Datasheet; ComponentLink1URL: http://www.kingbrightusa.com/images/catalog/SPEC/APT1608F3C.pdf; Digi-Key Part Number: 754-1433-1-ND; Supplier 1: Digi-Key; Supplier Part Number 1: 754-1433-1-ND; ClassName: 3D_EXPORT
J501-J503 = FPCx10: as J401 on sheet 105358-3SC002-01-A_IR; ComponentLink1URL: http://www.molex.com/pdm_docs/sd/5034801000_sd.pdf; ComponentLink1Description: Datasheet; Mounting Type: SMD; Digi-Key Part Number: WM1389CT-ND
Q501-Q503 = CSD13380F3T: as Q403 on sheet 105358-3SC002-01-A_IR; Digi-Key Part Number: CSD13380F3T; Manufacturer Part Number: CSD13380F3T; FET Type: N-Channel; Package / Case: 3-XFDFN; ComponentLink1Description: Datasheet; ComponentLink1URL: http://www.ti.com/lit/ds/symlink/csd13380f3.pdf
R501-R504 R508-R511 R513 R515-R517 R520 R521 R523 = 0603R-0R -1%-0.063W: as R401 on sheet 105358-3SC002-01-A_IR; Resistance (Ohms): 0R; PackageReference: 0603
R505-R507 R518 R519 = 0402R-100 OHM-1%-0.063W: as R415 on sheet 105358-3SC002-01-A_IR; Digi-Key Part Number: 311-100LRCT-ND; Resistance (Ohms): 100Ohm; Tolerance: 1%; PackageReference: 0402; Features: Moisture Resistant
R512 R514 R522 = 0402R-10k OHM-1%-0.063W: as R424 on sheet 105358-3SC002-01-A_IR; Digi-Key Part Number: 311-10.0KLRCT-ND; Resistance (Ohms): 10KOhm; Tolerance: 1%; PackageReference: 0402; Features: Moisture Resistant
T30-T50 = TEST POINT: Testing Poiny
TP501 TP503 TP505 TP506 TP521 TP523 = TP_C_R0603: as TP401 on sheet 105358-3SC002-01-A_IR; ClassName: TP
TP518 TP520 TP530 = TP_V_HOOK: as TP421 on sheet 105358-3SC002-01-A_IR; Digi-Key Part Number: 36-5001-ND
U501 = TSOP57256HTT1: as U401 on sheet 105358-3SC002-01-A_IR; ComponentLink1URL: http://www.vishay.com/docs/82434/tsop572.pdf; ComponentLink1Description: Datasheet; Manufacturer Part Number: TSOP57256HTT1; Digi-Key Part Number: TSOP57256HTT1-ND
U502 U503 = VSOP38336: IC SIGNAL CONDITIONING 36KHZ QFN; Manufacturer: Vishay Semiconductor Opto Division; Voltage - Supply: 2.5V ~ 5.5V; Current - Supply: 350µA; ComponentLink1URL: http://www.vishay.com/docs/82443/vsop383.pdf; ComponentLink1Description: Datasheet; Manufacturer Part Number: VSOP38336; PackageReference: 8-XFBGA, DSBGA; Digi-Key Part Number: VSOP38336CT-ND; B.P.F. Center Frequency: 36KHz

## Nets that join several sheets
3V: 105358-3SC002-01-A_BlockDiagram (J3.1), 105358-3SC002-01-A_PWR_MGMT (J201.1 R207.2 TP209.2), 105358-3SC002-01-A_IR (J404.2 T27.1)
9V: 105358-3SC002-01-A_PWR_MGMT (R219.2 TP202.2), 105358-3SC002-01-A_CPU (C304.1 R322.2)
CPU_VCC: 105358-3SC002-01-A_PWR_MGMT (J201.2), 105358-3SC002-01-A_CPU (9 pins)
GND: 105358-3SC002-01-A_BlockDiagram (5 pins), 105358-3SC002-01-A_PWR_MGMT (31 pins), 105358-3SC002-01-A_CPU (24 pins), 105358-3SC002-01-A_IR (38 pins), 105358-3SC002-01-A_IR_extra (24 pins)
VBATT: 105358-3SC002-01-A_PWR_MGMT (7 pins), 105358-3SC002-01-A_CPU (SW302.1)
5V_USB_IN: 105358-3SC002-01-A_BlockDiagram (D1.2 J1.1), 105358-3SC002-01-A_PWR_MGMT (R208.1 TP210.1)
AI_LASER_CURRENT: 105358-3SC002-01-A_CPU (J303.19), 105358-3SC002-01-A_IR (J404.9 T23.1)
AIN_IR_RECEIVER: 105358-3SC002-01-A_CPU (J301.3), 105358-3SC002-01-A_IR (J404.6)
CHARGER_FLAG: 105358-3SC002-01-A_PWR_MGMT (U203.E1), 105358-3SC002-01-A_CPU (J302.16)
CHARGER_MS: 105358-3SC002-01-A_PWR_MGMT (R211.2 R212.1 TP223.1), 105358-3SC002-01-A_CPU (J302.8)
CHARGER_MS_EN: 105358-3SC002-01-A_PWR_MGMT (R210.1 TP215.1 U203.C2), 105358-3SC002-01-A_CPU (R336.2)
CHARGER_SD: 105358-3SC002-01-A_PWR_MGMT (R209.1 U203.A1), 105358-3SC002-01-A_CPU (J303.23 Q302.G)
DEBUG_UART_RX: 105358-3SC002-01-A_BlockDiagram (J1.2), 105358-3SC002-01-A_CPU (R309.1)
DEBUG_UART_TX: 105358-3SC002-01-A_BlockDiagram (J1.3), 105358-3SC002-01-A_CPU (R305.1)
DOUT_DISP_9V_EN: 105358-3SC002-01-A_PWR_MGMT (R204.1 U202.C1), 105358-3SC002-01-A_CPU (R321.2)
DOUT_IR_EN: 105358-3SC002-01-A_CPU (J303.9), 105358-3SC002-01-A_IR (J404.4)
DOUT_IR_REC_VCC: 105358-3SC002-01-A_CPU (J301.9), 105358-3SC002-01-A_IR (J404.5)
I2C_SCL: 105358-3SC002-01-A_CPU (5 pins), 105358-3SC002-01-A_IR (J404.10 T18.1)
I2C_SDA: 105358-3SC002-01-A_CPU (5 pins), 105358-3SC002-01-A_IR (J404.3 T26.1)
IO_TP_1: 105358-3SC002-01-A_CPU (J301.11), 105358-3SC002-01-A_IR (J404.7 T25.1)
IO_TP_2: 105358-3SC002-01-A_CPU (J301.15), 105358-3SC002-01-A_IR (J404.8 T24.1)
SNS_TOUCH: 105358-3SC002-01-A_BlockDiagram (R1.2 R2.2), 105358-3SC002-01-A_CPU (J303.3)
SWDCK: 105358-3SC002-01-A_BlockDiagram (J3.4), 105358-3SC002-01-A_CPU (J302.12)
SWDIO: 105358-3SC002-01-A_BlockDiagram (J3.5), 105358-3SC002-01-A_CPU (J303.25)
V_BATT: 105358-3SC002-01-A_BlockDiagram (J2.1), 105358-3SC002-01-A_PWR_MGMT (R218.2 TP225.2)
WAKE_UP: 105358-3SC002-01-A_PWR_MGMT (U203.D2), 105358-3SC002-01-A_CPU (R313.2 TP309.1)
XRES: 105358-3SC002-01-A_BlockDiagram (J3.3), 105358-3SC002-01-A_CPU (J301.7)